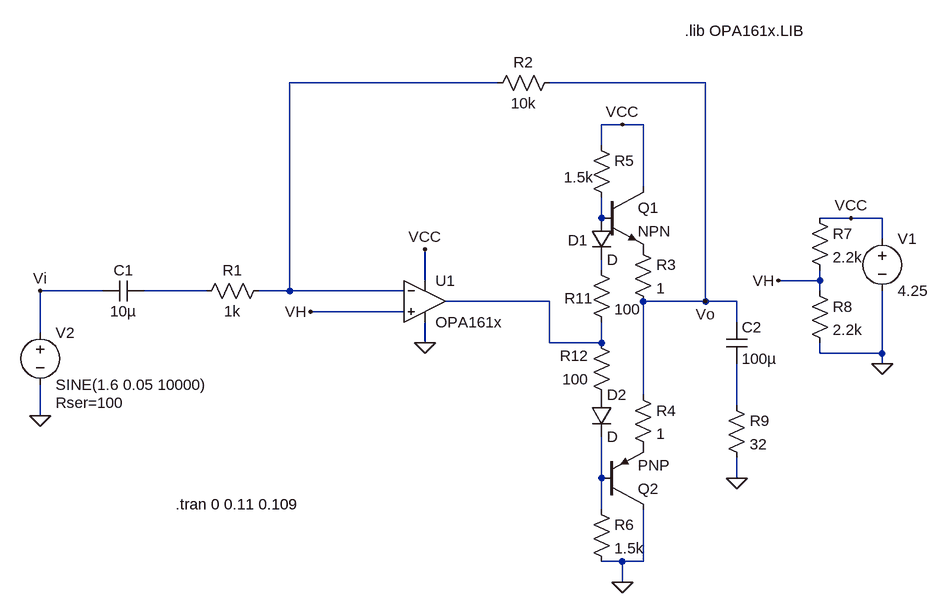
[diagram p0: schematic DAC_Amp.asc]
DAC_Amp.asc, the LTspice schematic file:
Version 4.1
SHEET 1 896 680
WIRE 224 -192 -96 -192
WIRE 544 -192 304 -192
WIRE 416 -128 384 -128
WIRE 448 -128 416 -128
WIRE 384 -96 384 -128
WIRE 448 -32 448 -128
WIRE 384 16 384 -16
WIRE 768 16 720 16
WIRE 816 16 768 16
WIRE 816 48 816 16
WIRE 384 96 384 80
WIRE 112 112 112 64
WIRE 720 112 720 96
WIRE 720 112 656 112
WIRE -384 128 -480 128
WIRE -224 128 -320 128
WIRE -96 128 -96 -192
WIRE -96 128 -144 128
WIRE 80 128 -96 128
WIRE 720 128 720 112
WIRE 304 144 144 144
WIRE 544 144 544 -192
WIRE 544 144 448 144
WIRE 592 144 544 144
WIRE 80 160 -64 160
WIRE 592 176 592 144
WIRE -480 192 -480 128
WIRE 112 208 112 176
WIRE 304 208 304 144
WIRE 384 208 384 176
WIRE 384 208 304 208
WIRE 720 224 720 208
WIRE 816 224 816 128
WIRE 816 224 720 224
WIRE 816 240 816 224
WIRE 448 288 448 144
WIRE 592 304 592 240
WIRE -480 320 -480 272
WIRE 384 416 384 352
WIRE 592 416 592 384
WIRE 384 464 384 416
WIRE 416 544 384 544
WIRE 448 544 448 464
WIRE 448 544 416 544
WIRE 416 576 416 544
FLAG 112 208 0
FLAG 816 240 0
FLAG -480 320 0
FLAG 768 16 VCC
FLAG 112 64 VCC
FLAG 416 -128 VCC
FLAG 416 576 0
FLAG 656 112 VH
FLAG -64 160 VH
FLAG 544 144 Vo
FLAG -480 128 Vi
FLAG 592 416 0
SYMBOL voltage 816 32 R0
WINDOW 123 0 0 Left 0
WINDOW 39 0 0 Left 0
SYMATTR InstName V1
SYMATTR Value 4.25
SYMBOL res -128 112 R90
WINDOW 0 0 56 VBottom 2
WINDOW 3 32 56 VTop 2
SYMATTR InstName R1
SYMATTR Value 1k
SYMBOL res 320 -208 R90
WINDOW 0 0 56 VBottom 2
WINDOW 3 32 56 VTop 2
SYMATTR InstName R2
SYMATTR Value 10k
SYMBOL npn 384 -32 R0
SYMATTR InstName Q1
SYMBOL pnp 384 464 M180
SYMATTR InstName Q2
SYMBOL res 432 48 R0
SYMATTR InstName R3
SYMATTR Value 1
SYMBOL res 432 272 R0
SYMATTR InstName R4
SYMATTR Value 1
SYMBOL diode 368 16 R0
WINDOW 0 -36 34 Left 2
SYMATTR InstName D1
SYMBOL diode 368 288 R0
SYMATTR InstName D2
SYMBOL res 368 -112 R0
WINDOW 3 -42 65 Left 2
SYMATTR InstName R5
SYMATTR Value 1.5k
SYMBOL res 368 448 R0
SYMATTR InstName R6
SYMATTR Value 1.5k
SYMBOL cap -320 112 R90
WINDOW 0 0 32 VBottom 2
WINDOW 3 32 32 VTop 2
SYMATTR InstName C1
SYMATTR Value 10µ
SYMBOL voltage -480 176 R0
WINDOW 123 0 0 Left 0
WINDOW 39 24 124 Left 2
SYMATTR SpiceLine Rser=100
SYMATTR InstName V2
SYMATTR Value SINE(1.6 0.05 10000)
SYMBOL res 704 0 R0
SYMATTR InstName R7
SYMATTR Value 2.2k
SYMBOL res 704 112 R0
SYMATTR InstName R8
SYMATTR Value 2.2k
SYMBOL res 576 288 R0
SYMATTR InstName R9
SYMATTR Value 32
SYMBOL cap 576 176 R0
SYMATTR InstName C2
SYMATTR Value 100µ
SYMBOL res 368 80 R0
WINDOW 0 -41 59 Left 2
SYMATTR InstName R11
SYMATTR Value 100
SYMBOL res 400 304 R180
WINDOW 0 36 76 Left 2
WINDOW 3 36 40 Left 2
SYMATTR InstName R12
SYMATTR Value 100
SYMBOL OpAmps\\opamp2 112 80 R0
SYMATTR InstName U1
SYMATTR Value OPA161x
TEXT -272 456 Left 2 !.tran 0 0.11 0.109
TEXT 512 -272 Left 2 !.lib OPA161x.LIB

The netlist it stands for:
* DAC_Amp.asc
V1 VCC 0 4.25
R1 N001 N004 1k
R2 Vo N001 10k
Q1 VCC N002 P001 0 NPN
Q2 0 N007 P002 0 PNP
R3 P001 Vo 1
R4 Vo P002 1
D1 N002 N003 D
D2 P003 N007 D
R5 VCC N002 1.5k
R6 N007 0 1.5k
C1 N004 Vi 10µ
V2 Vi 0 SINE(1.6 0.05 10000) Rser=100
R7 VCC VH 2.2k
R8 VH 0 2.2k
R9 N006 0 32
C2 Vo N006 100µ
R11 N003 N005 100
R12 P003 N005 100
X§U1 VH N001 VCC 0 N005 OPA161x  ; pins In+ In- V+ V- OUT
.model D D
.lib standard.dio
.model NPN NPN
.model PNP PNP
.lib standard.bjt
.tran 0 0.11 0.109
.lib OPA161x.LIB
.backanno
.end